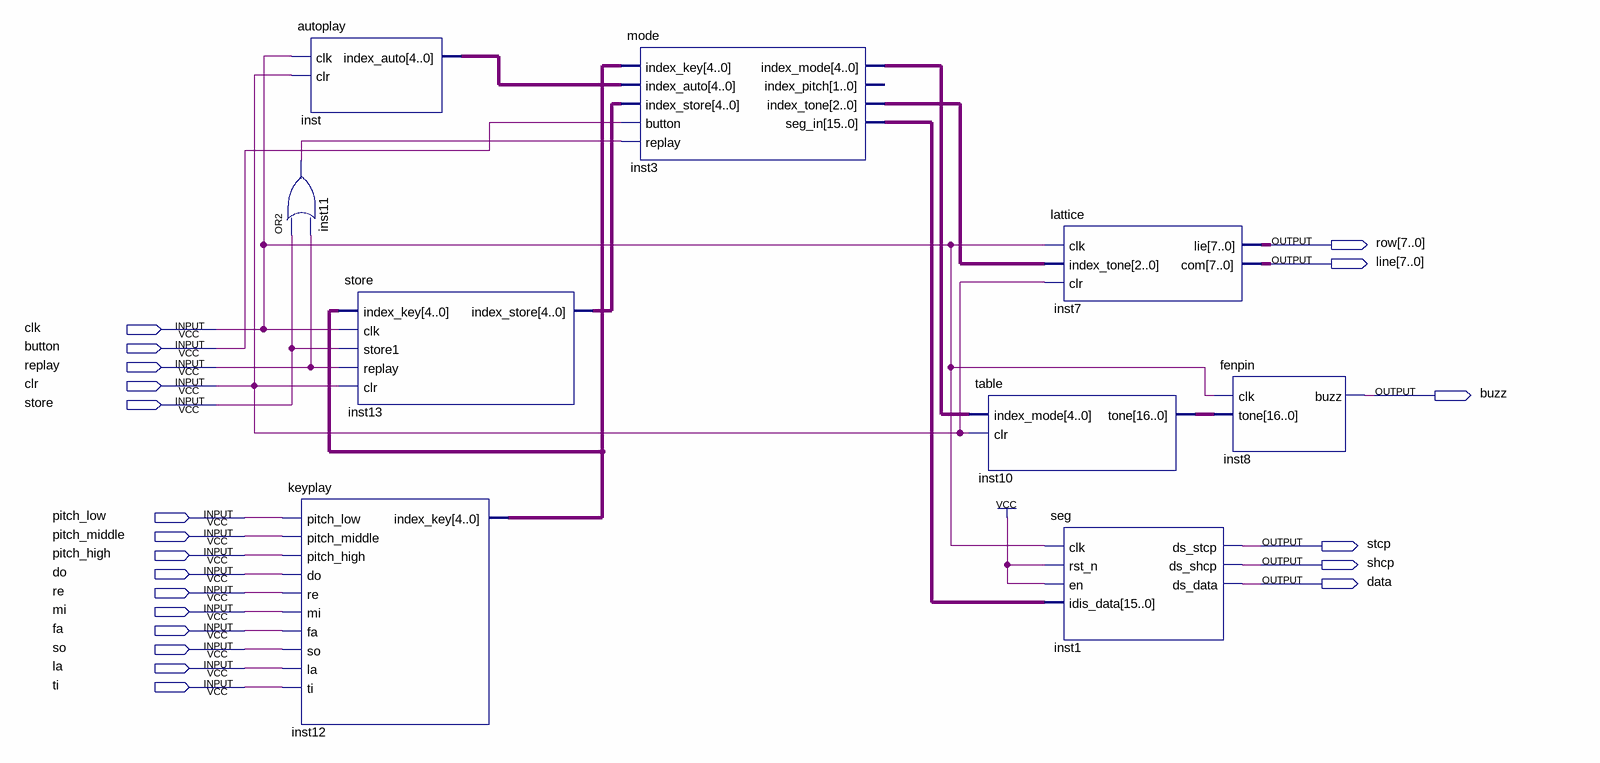
[diagram p0: schematic sheet]
// Quartus schematic piano.bdf as structural Verilog: 9 symbols, 21 pins
module piano (
  input  clk,
  input  button,
  input  replay,
  input  clr,
  input  store,
  input  pitch_low,
  input  pitch_middle,
  input  pitch_high,
  input  \do ,
  input  re,
  input  mi,
  input  fa,
  input  so,
  input  la,
  input  ti,
  output [7:0] row,
  output [7:0] line,
  output buzz,
  output stcp,
  output shcp,
  output data
);

  wire inst11_out;
  wire [2:0] inst3_index_tone;
  wire [4:0] inst3_index_mode, inst12_index_key, inst13_index_store, inst_index_auto;
  wire [15:0] inst3_seg_in;
  wire [16:0] inst10_tone;

  autoplay inst (.clk(clk), .clr(clr), .index_auto(inst_index_auto));
  or inst11 (inst11_out, store, replay);
  keyplay inst12 (
    .pitch_low(pitch_low), .pitch_middle(pitch_middle), .pitch_high(pitch_high), .\do (\do ), .re(re),
    .mi(mi), .fa(fa), .so(so), .la(la), .ti(ti), .index_key(inst12_index_key));
  store inst13 (
    .index_key(inst12_index_key), .clk(clk), .store1(store), .replay(replay), .clr(clr),
    .index_store(inst13_index_store));
  mode inst3 (
    .index_key(inst12_index_key), .index_auto(inst_index_auto), .index_store(inst13_index_store),
    .button(button), .replay(inst11_out), .index_mode(inst3_index_mode), .index_tone(inst3_index_tone),
    .seg_in(inst3_seg_in));  // open: index_pitch
  \table  inst10 (.index_mode(inst3_index_mode), .clr(clr), .tone(inst10_tone));
  lattice inst7 (.clk(clk), .index_tone(inst3_index_tone), .clr(clr), .lie(row), .com(line));
  seg inst1 (
    .clk(clk), .rst_n(1'b1), .en(1'b1), .idis_data(inst3_seg_in), .ds_stcp(stcp), .ds_shcp(shcp),
    .ds_data(data));
  fenpin inst8 (.clk(clk), .tone(inst10_tone), .buzz(buzz));
endmodule
